# EAGLE design ArduinoBoardMK1 (EAGLE 9.2.0)
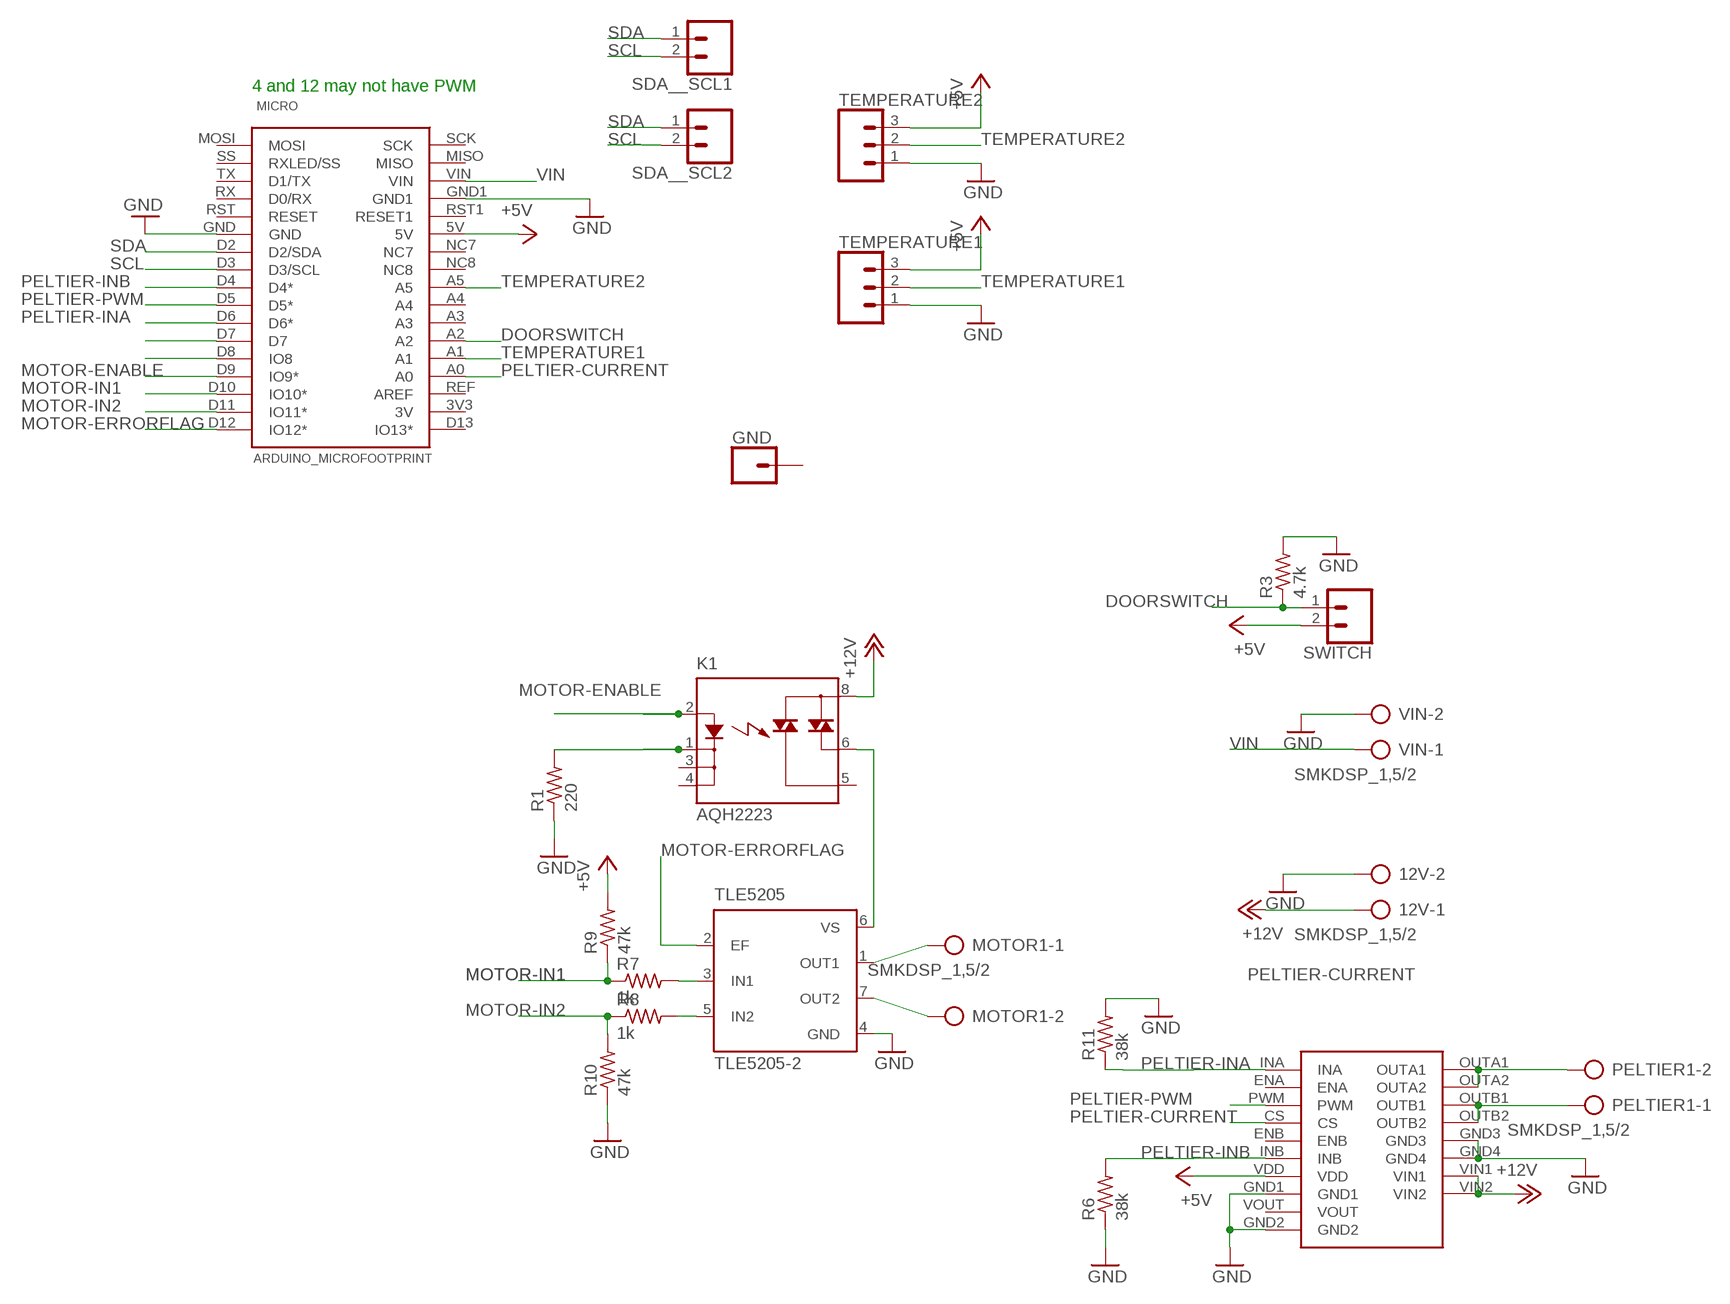
[diagram p0: schematic, sheet 1]

## Parts
12V  SMKDSP_1,5/2  [SMKDSP_1,5/2]
GND  CONN_01  [1X01]
K1  AQH2223  [DIL07]
MICRO  ARDUINO_MICROFOOTPRINT  [ARDUINO-MICRO]
MOTOR1  SMKDSP_1,5/2  [SMKDSP_1,5/2]
PELTIER1  SMKDSP_1,5/2  [SMKDSP_1,5/2]
R1  220  R-US_0207/12  [0207/12]
R3  4.7k  R-US_0207/12  [0207/12]
R6  38k  R-US_0207/12  [0207/12]
R7  1k  R-US_0207/12  [0207/12]
R8  1k  R-US_0207/12  [0207/12]
R9  47k  R-US_0207/12  [0207/12]
R10  47k  R-US_0207/12  [0207/12]
R11  38k  R-US_0207/12  [0207/12]
SDA__SCL1  CONN_02PTH3  [1X02_LONGPADS]
SDA__SCL2  CONN_02PTH3  [1X02_LONGPADS]
SWITCH  CONN_02PTH3  [1X02_LONGPADS]
TEMPERATURE1  CONN_03LONGPADS  [1X03_LONGPADS]
TEMPERATURE2  CONN_03LONGPADS  [1X03_LONGPADS]
TLE5205  TLE5205-2  [P-TO220-7-11]
VIN  SMKDSP_1,5/2  [SMKDSP_1,5/2]
VNH5019  VNH5019VNH5019BOARD  [DIP3302W60P254L2400H500Q20B]

## Nets
+5V: MICRO.5V R9.2 SWITCH.2 TEMPERATURE1.3 TEMPERATURE2.3 VNH5019.VDD
+12V: 12V.1 K1.8(DS1) VNH5019.VIN1 VNH5019.VIN2
DOORSWITCH: MICRO.A2 R3.1 SWITCH.1
GND: 12V.2 MICRO.GND MICRO.GND1 R1.1 R3.2 R6.1 R10.1 R11.2 TEMPERATURE1.1 TEMPERATURE2.1 TLE5205.4(GND) VIN.2 VNH5019.GND1 VNH5019.GND2 VNH5019.GND3 VNH5019.GND4
IN1: R7.2 TLE5205.3(IN1)
IN2: R8.2 TLE5205.5(IN2)
MOTOR-ENABLE: K1.2(A) MICRO.D9(IO9*)
MOTOR-ERRORFLAG: MICRO.D12(IO12*) TLE5205.2(EF)
MOTOR-IN1: MICRO.D10(IO10*) R7.1 R9.1
MOTOR-IN2: MICRO.D11(IO11*) R8.1 R10.2
MOTOR-OUT1: MOTOR1.1 TLE5205.1(OUT1)
MOTOR-OUT2: MOTOR1.2 TLE5205.7(OUT2)
N$21: MICRO.D7
N$22: MICRO.D8(IO8)
PELTIER-CURRENT: MICRO.A0 VNH5019.CS
PELTIER-INA: MICRO.D6(D6*) R11.1 VNH5019.INA
PELTIER-INB: MICRO.D4(D4*) R6.2 VNH5019.INB
PELTIER-OUTA: PELTIER1.2 VNH5019.OUTA1 VNH5019.OUTA2
PELTIER-OUTB: PELTIER1.1 VNH5019.OUTB1 VNH5019.OUTB2
PELTIER-PWM: MICRO.D5(D5*) VNH5019.PWM
POST-OPTO-DIODE: K1.1(K) R1.2
RELAY-TO-MOTORCONTROLLER: K1.6(DS3) TLE5205.6(VS)
SCL: MICRO.D3(D3/SCL) SDA__SCL1.2 SDA__SCL2.2
SDA: MICRO.D2(D2/SDA) SDA__SCL1.1 SDA__SCL2.1
TEMPERATURE1: MICRO.A1 TEMPERATURE1.2
TEMPERATURE2: MICRO.A5 TEMPERATURE2.2
VIN: MICRO.VIN VIN.1
Unconnected: GND.1 K1.3(K1) K1.4(K2) K1.5(DS2) MICRO.3V3(3V) MICRO.A3 MICRO.A4 MICRO.D13(IO13*) MICRO.MISO MICRO.MOSI MICRO.NC7 MICRO.NC8 MICRO.REF(AREF) MICRO.RST1(RESET1) MICRO.RST(RESET) MICRO.RX(D0/RX) MICRO.SCK MICRO.SS(RXLED/SS) MICRO.TX(D1/TX) VNH5019.ENA VNH5019.ENB VNH5019.VOUT

## Notes on the sheet
- 4 and 12 may not have PWM

## Library data of the parts
12V MOTOR1 PELTIER1 VIN = con-phoenix-smkdsp:SMKDSP_1,5/2: Printklemme, Nennstrom: 17,5 A, Bemessungsspannung: 250 V, Raster: 5,0 mm Source: http://eshop.phoenixcontact.de .. 1733415.pdf; MF: FARNELL; MPN: 1733570; OC_FARNELL: 3041244; OC_NEWARK: 69C8588
GND = SparkFun-Connectors:CONN_01: Single connection point. Often used as Generic Header-pin footprint for 0.1 inch spaced/style header connections On any of the 0.1 inch spaced packages, you can populate with these: Break Away Headers - Straight <https://www.sparkfun.com/products/116> (PRT-00116) Break Away Male Headers - Right Angle <https://www.sparkfun.com/products/553> (PRT-00553) Female Headers <https://www.sparkfun.com/products/115> (PRT-00115) Break Away Headers - Machine Pin <https://www.sparkfun.com/products/117> (PRT-00117) Break Away Female Headers - Swiss Machine Pin <https://www.sparkfun.com/products/743> (PRT-00743) This device is also useful as a general connection point to wire up your design to another part of your project. Our various solder wires solder well into these plated through hole pads. Hook-Up Wire - Assortment (Stranded, 22 AWG) <https://www.sparkfun.com/products/11375> (PRT-11375) Hook-Up Wire - Assortment (Solid Core, 22 AWG) <https://www.sparkfun.com/products/11367> (PRT-11367) View the entire wire category on our website here <https://www.sparkfun.com/categories/141> Special notes: SMTSO-256-ET is a "flush mount" nut for a 4-40 screw. We mostly use this on specialty testbeds; it is a nice way to connect hardware to your PCB at an adjustable hieght. Also note, the SNAP packages are for using a snappable style connector. We sell a baggie of snaps and they are also used on two LilyPad designs: Snap Assortment - 30 pack (male and female) <https://www.sparkfun.com/products/11347> (DEV-11347) LilyPad Arduino SimpleSnap <https://www.sparkfun.com/products/10941> (DEV-10941) LilyPad SimpleSnap Protoboard <https://www.sparkfun.com/products/10940> (DEV-10940)
K1 = relay:AQH*223: SOLID STATE RELAY NAiS Source: http://www.mew-europe.com/.. en_ds_61613_0000.pdf; MF: AROMAT/ MATSUSHITA; MPN: AQH2223; OC_FARNELL: unknown; OC_NEWARK: 26K3059
MICRO = arduino-micro:ARDUINO_MICRO
R1 R3 R6-R11 = resistor:R-US_: RESISTOR, American symbol
SDA__SCL1 SDA__SCL2 SWITCH = SparkFun-Connectors:CONN_02: Multi connection point. Often used as Generic Header-pin footprint for 0.1 inch spaced/style header connections On any of the 0.1 inch spaced packages, you can populate with these: Break Away Headers - Straight <https://www.sparkfun.com/products/116> (PRT-00116) Break Away Male Headers - Right Angle <https://www.sparkfun.com/products/553> (PRT-00553) Female Headers <https://www.sparkfun.com/products/115> (PRT-00115) Break Away Headers - Machine Pin <https://www.sparkfun.com/products/117> (PRT-00117) Break Away Female Headers - Swiss Machine Pin <https://www.sparkfun.com/products/743> (PRT-00743) For SCREWTERMINALS and SPRING TERMINALS visit here: Screw Terimnals on SparkFun.com <https://www.sparkfun.com/search/results?term=Screw+Terminals> (5mm/3.5mm/2.54mm spacing) This device is also useful as a general connection point to wire up your design to another part of your project. Our various solder wires solder well into these plated through hole pads. Hook-Up Wire - Assortment (Stranded, 22 AWG) <https://www.sparkfun.com/products/11375> (PRT-11375) Hook-Up Wire - Assortment (Solid Core, 22 AWG) <https://www.sparkfun.com/products/11367> (PRT-11367) View the entire wire category on our website here <https://www.sparkfun.com/categories/141> Special notes: Molex polarized connector foot print use with: PRT-08233 with associated crimp pins and housings. 2.54_SCREWTERM for use with PRT-10571. 3.5mm Screw Terminal footprints for PRT-08084 5mm Screw Terminal footprints for use with PRT-08432
TEMPERATURE1 TEMPERATURE2 = SparkFun-Connectors:CONN_03: Multi connection point. Often used as Generic Header-pin footprint for 0.1 inch spaced/style header connections On any of the 0.1 inch spaced packages, you can populate with these: Break Away Headers - Straight <https://www.sparkfun.com/products/116> (PRT-00116) Break Away Male Headers - Right Angle <https://www.sparkfun.com/products/553> (PRT-00553) Female Headers <https://www.sparkfun.com/products/115> (PRT-00115) Break Away Headers - Machine Pin <https://www.sparkfun.com/products/117> (PRT-00117) Break Away Female Headers - Swiss Machine Pin <https://www.sparkfun.com/products/743> (PRT-00743) Stackable Header - 3 Pin (Female, 0.1") <https://www.sparkfun.com/products/13875> (PRT-13875) For SCREWTERMINALS and SPRING TERMINALS visit here: Screw Terimnals on SparkFun.com <https://www.sparkfun.com/search/results?term=Screw+Terminals> (5mm/3.5mm/2.54mm spacing) This device is also useful as a general connection point to wire up your design to another part of your project. Our various solder wires solder well into these plated through hole pads. Hook-Up Wire - Assortment (Stranded, 22 AWG) <https://www.sparkfun.com/products/11375> (PRT-11375) Hook-Up Wire - Assortment (Solid Core, 22 AWG) <https://www.sparkfun.com/products/11367> (PRT-11367) View the entire wire category on our website here <https://www.sparkfun.com/categories/141> Special notes: Molex polarized connector foot print use with SKU : PRT-08232 with associated crimp pins and housings.
TLE5205 = infineon:TLE5205-2: 5-A H-Bridge for DC-Motor Applications Source: http://www.infineon.com .. tle5205-2.pdf; OC_FARNELL: unknown; OC_NEWARK: unknown
VNH5019 = GEMS:VNH5019

## Board
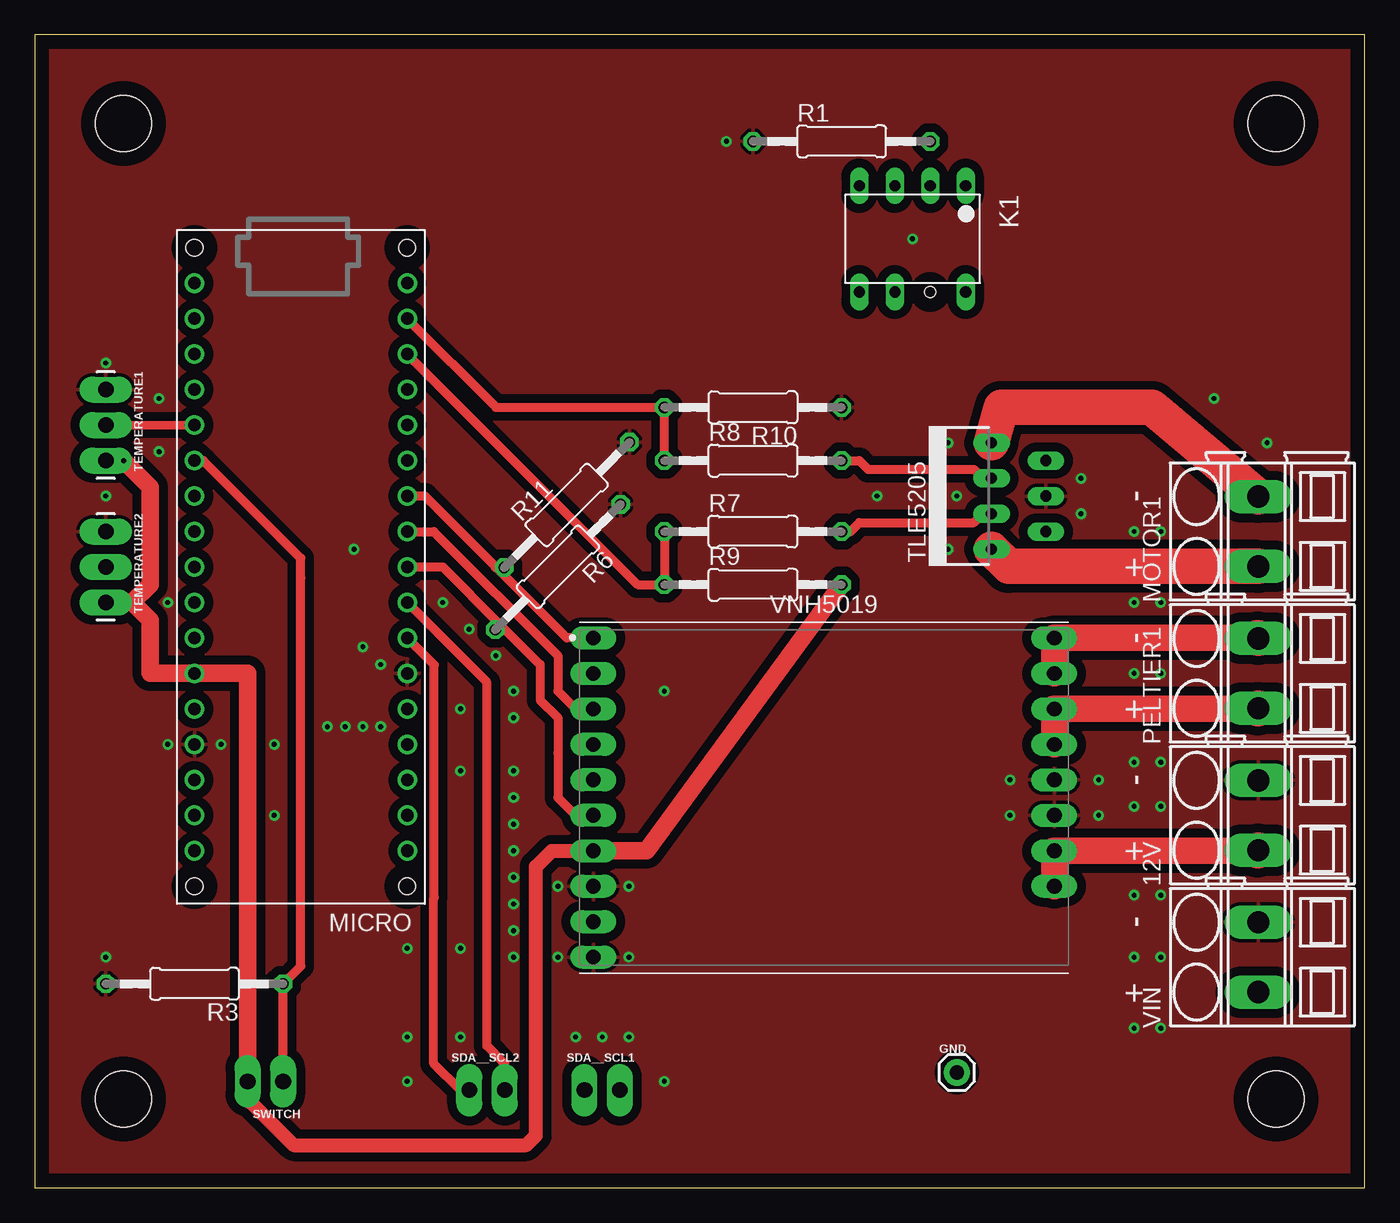
[diagram p1: board, top side]
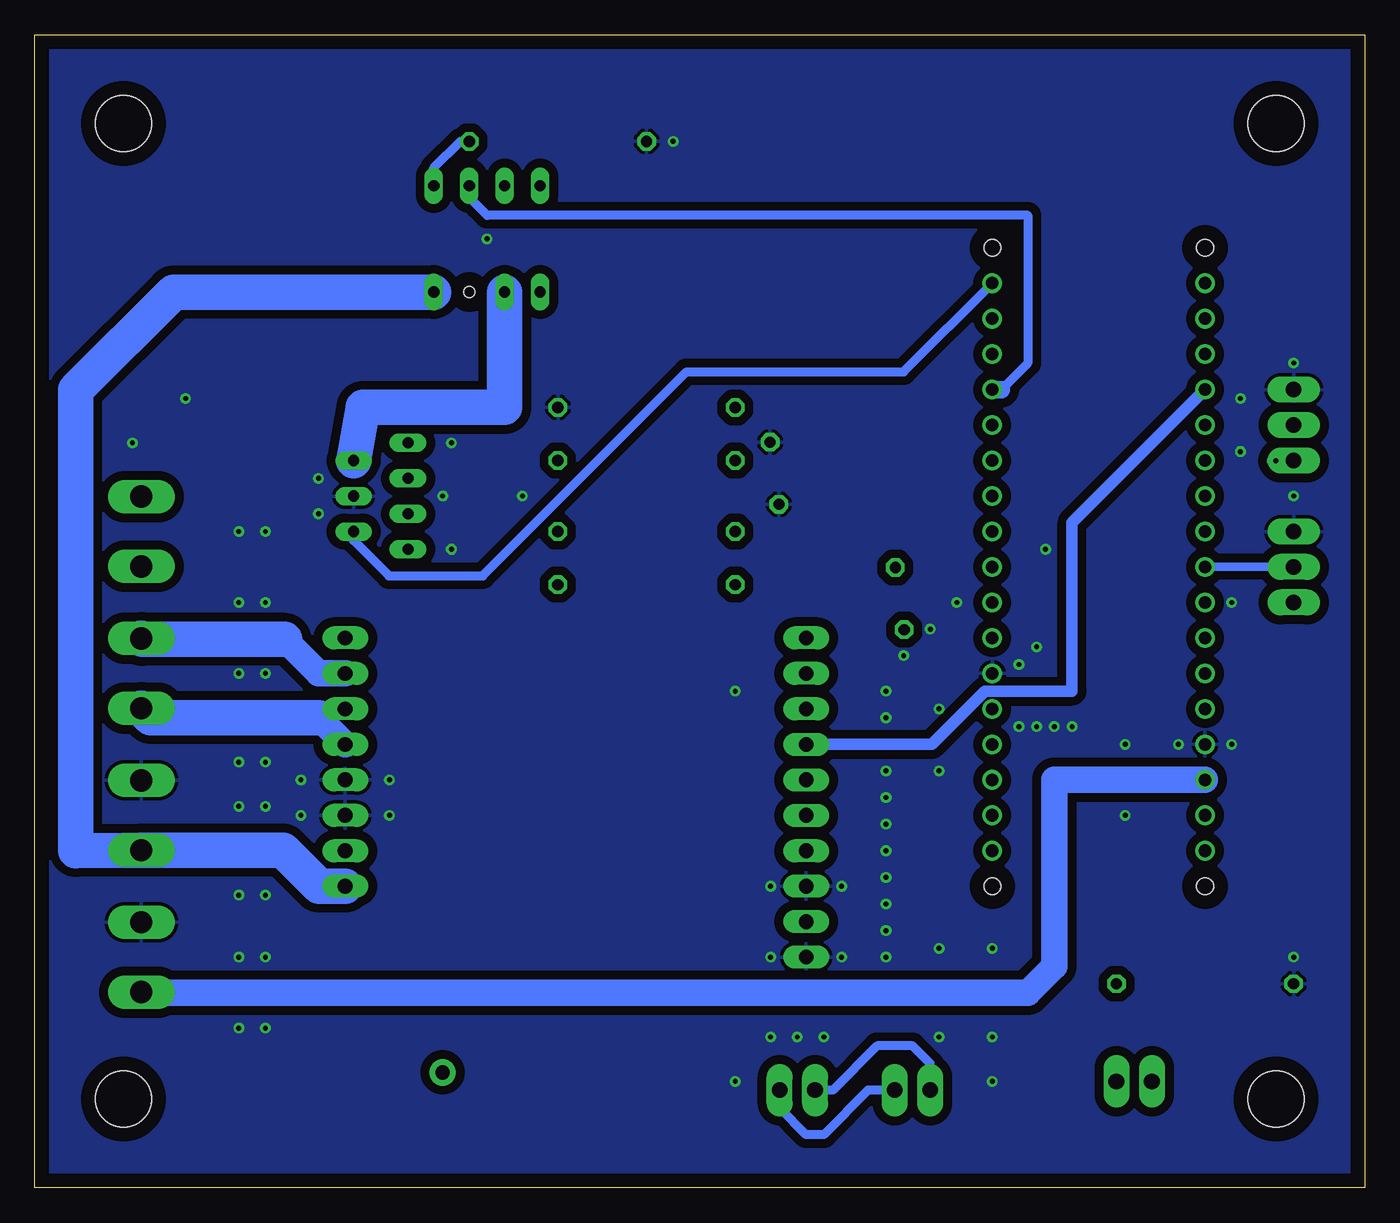
[diagram p2: board, bottom side, seen from below]

Size 95.25 x 82.55 mm. Coordinates in mm from the lower left corner, seen from the top.
Outline: 0,0 95.25,0 95.25,82.55 0,82.55 0,0
Copper layers (1*16): Top 0.035mm / dielectric 1.5mm / Bottom 0.035mm
Design rules "default *": minimum track width 6mil, minimum drill 0.35mm, track to track 25mil, track to pad 20mil, pad to pad 6mil, via to via 25mil, smd to smd 6mil, copper to edge 40mil, drill to drill 6mil, minimum pad ring 10mil, minimum via ring 8mil, stop-mask expansion 4mil, vias tented up to drill 0mil, thermal gap 10mil
Holes 4 mm at 6.35,76.2 88.9,76.2 88.9,6.35 6.35,6.35
Holes 0.8 mm at 64.14,64.14

### Footprints (pad centres in the part's own frame; a part is rotated, then mirrored left to right if it is on the bottom)
SMKDSP_1,5/2 = drill 1.6 pad 1.8 long: 1 -2.5,0; 2 2.5,0
1X01 = drill 1.016 pad 1.88: 1 0,0
DIL07 = drill 0.8 long: 1 -3.81,-3.81; 2 -1.27,-3.81; 3 1.27,-3.81; 4 3.81,-3.81; 5 3.81,3.81; 6 1.27,3.81; 8 -3.81,3.81
ARDUINO-MICRO = drill 0.9: 3V3 16.51,3.81; 5V 16.51,29.21; A0 16.51,8.89; A1 16.51,11.43; A2 16.51,13.97; A3 16.51,16.51; A4 16.51,19.05; A5 16.51,21.59; D2 1.27,26.67; D3 1.27,24.13; D4 1.27,21.59; D5 1.27,19.05; D6 1.27,16.51; D7 1.27,13.97; D8 1.27,11.43; D9 1.27,8.89; D10 1.27,6.35; D11 1.27,3.81; D12 1.27,1.27; D13 16.51,1.27; GND 1.27,29.21; GND1 16.51,34.29; MISO 16.51,39.37; MOSI 1.27,41.91; NC7 16.51,26.67; NC8 16.51,24.13; REF 16.51,6.35; RST 1.27,31.75; RST1 16.51,31.75; RX 1.27,34.29; SCK 16.51,41.91; SS 1.27,39.37; TX 1.27,36.83; VIN 16.51,36.83 | hole 1.2: 1.27,-1.27; 16.51,-1.27; 1.27,44.45; 16.51,44.45
0207/12 = drill 0.813 octagon: 1 -6.35,0; 2 6.35,0
1X02_LONGPADS = drill 1.118 pad 1.88 long: 1 0,0; 2 2.54,0
1X03_LONGPADS = drill 1.118 pad 1.88 long: 1 0,0; 2 2.54,0; 3 5.08,0
P-TO220-7-11 = drill 0.8 pad 1.2 long: 1 -3.81,-1.85; 2 -2.54,-5.75; 3 -1.27,-1.85; 4 0,-5.75; 5 1.27,-1.85; 6 2.54,-5.75; 7 3.81,-1.85
DIP3302W60P254L2400H500Q20B = drill 1.048 pad 1.649 long: CS -16.51,3.81; ENA -16.51,8.89; ENB -16.51,1.27; GND1 -16.51,-6.35; GND2 -16.51,-11.43; GND3 16.51,1.27; GND4 16.51,-1.27; INA -16.51,11.43; INB -16.51,-1.27; OUTA1 16.51,11.43; OUTA2 16.51,8.89; OUTB1 16.51,6.35; OUTB2 16.51,3.81; PWM -16.51,6.35; VDD -16.51,-3.81; VIN1 16.51,-3.81; VIN2 16.51,-6.35; VOUT -16.51,-8.89

### Placement (x,y rotation side)
12V  87.63,26.67 90 top
GND  66.04,8.26 0 top
K1  62.87,67.94 180 top
MICRO  27.94,66.04 180 top
MOTOR1  87.63,46.99 90 top
PELTIER1  87.63,36.83 90 top
R1  57.78,74.93 0 top
R3  11.43,14.61 180 top
R6  47k  [0207/12]  37.47,44.45 225 top
R7  51.44,46.99 0 top
R8  51.44,52.07 0 top
R9  51.44,43.18 0 top
R10  51.44,55.88 180 top
R11  47k  [0207/12]  38.1,48.9 45 top
SDA__SCL1  39.37,6.99 0 top
SDA__SCL2  31.11,6.99 0 top
SWITCH  17.78,7.62 180 top
TEMPERATURE1  5.08,57.15 270 top
TEMPERATURE2  5.08,46.99 270 top
TLE5205  66.67,49.53 90 top
VIN  87.63,16.51 90 top
VNH5019  56.52,27.94 0 top

### Tracks (layer width: path | path; a pad name or v marks a point on that pad's centre or on a via)
+5V  (via drill 0.35)
  Top 1.016: 15.24,6.35 18.54,3.05 35.19,3.05 35.89,3.75 35.89,22.98 37.04,24.13 VNH5019.VDD
  Top 1.27: VNH5019.VDD 43.81,24.13 R9.2 | 15.24,6.35 SWITCH.2 15.24,36.83 MICRO.5V 8.26,36.83 8.26,40.64 6.99,41.91 | v6.35,52.07 8.26,50.16 8.26,43.18 6.99,41.91 | TEMPERATURE2.3 6.99,41.91
  Bottom 1.27: TEMPERATURE1.3 v6.35,52.07
+12V
  Top 1.905: 87.59,24.13 VNH5019.VIN1 VNH5019.VIN2
  Top 2.54: 87.59,24.13 12V.1
  Bottom 2.54: K1.8 85.32,64.14 92.31,57.15 92.31,24.13 12V.1 77.47,24.17 74.89,21.59 VNH5019.VIN2
DOORSWITCH
  Top 0.635: SWITCH.1 R3.1 19.05,15.88 19.05,43.64 19.05,45.09 12.06,52.07 MICRO.A2
GND  (via drill 0.35)
  other vias: 65.41,45.72 8.89,52.7 45.09,35.56 65.41,53.34 34.29,18.41 34.29,20.32 34.29,22.23 34.29,26.04 34.29,27.94 34.29,29.84 34.29,33.66 34.29,35.56 33.02,38.1 31.11,40.01 29.21,41.91 23.5,38.73 22.86,45.72 9.53,41.91 8.89,56.52 5.08,59.05 5.08,49.53 9.53,31.75 13.34,31.75 26.67,17.14 26.67,10.79 26.67,7.62 38.73,10.79 40.64,10.79 42.55,10.79 45.09,7.62 69.85,26.67 69.85,29.21 76.2,26.67 76.2,29.21 34.29,24.13 37.47,16.51 42.55,16.51 42.55,21.59 37.47,21.59 78.74,41.91 80.64,41.91 78.74,36.83 80.64,36.83 78.74,30.48 80.64,30.48 78.74,27.3 80.64,27.3 78.74,20.95 80.64,20.95 80.64,46.99 78.74,46.99 78.74,16.51 80.64,16.51 17.14,26.67 78.74,11.43 80.64,11.43 17.14,31.75 30.48,29.84 30.48,34.29 24.77,37.47 24.77,33.02 22.23,33.02 20.95,33.02 30.48,17.14 30.48,10.79 60.33,49.53 66.04,49.53 74.93,50.8 74.93,48.26 84.45,56.52 88.27,53.34 49.53,74.93 62.87,67.94 5.08,16.51 34.29,16.51 23.5,33.02
  pour Bottom (isolate 0.381): -0.64,83.82 -0.64,-0.64 99.69,-0.64 99.69,83.82
  pour Top (isolate 0.381): -1.91,85.09 -1.91,-1.27 99.69,-1.27 99.69,85.09
IN1
  Top 0.635: R7.2 58.42,46.99 59.05,47.62 67.25,47.62 67.89,48.26 TLE5205.3
IN2
  Top 0.635: R8.2 59.05,52.07 59.69,51.44 67.25,51.44 67.89,50.8 TLE5205.5
MOTOR-ENABLE
  Bottom 0.635: 26.04,57.15 24.13,59.05 24.13,69.62 62.84,69.62 63.49,70.27 64.14,70.91 K1.2
  Bottom 1.27: 26.04,57.15 MICRO.D9
MOTOR-ERRORFLAG
  Bottom 0.635: MICRO.D12 33.02,58.42 48.57,58.42 63.17,43.81 69.89,43.81 72.42,46.35 TLE5205.2
MOTOR-IN1
  Top 0.635: R7.1 R9.1 43.18,43.18 MICRO.D10
MOTOR-IN2
  Top 0.635: R8.1 R10.2 33.02,55.88 MICRO.D11
MOTOR-OUT1
  Top 2.54: MOTOR1.1 69.75,44.49 TLE5205.1
MOTOR-OUT2
  Top 2.54: MOTOR1.2 80.01,55.88 69.22,55.88 TLE5205.7
PELTIER-CURRENT
  Bottom 0.813: VNH5019.CS 31,31.75 27.19,35.55 20.95,35.55 20.95,47.62 MICRO.A0
PELTIER-INA
  Top 0.635: MICRO.D6 27.94,49.53 33.34,44.13 | VNH5019.INA 38.1,39.37 33.34,44.13 | R11.1 32.98,44.41 | R11.1 33.34,44.13 | R11.1
PELTIER-INB
  Top 0.635: 33.34,40.32 29.21,44.45 MICRO.D4 | 33.34,40.32 36.2,37.47 36.2,34.92 37.47,33.66 37.47,31.11 37.47,27.94 38.73,26.67 39.37,26.67 VNH5019.INB | R6.2 33.34,40.32
PELTIER-OUTA
  Top 1.905: 87.59,39.37 VNH5019.OUTA1 VNH5019.OUTA2
  Top 2.54: 87.59,39.37 PELTIER1.2
  Bottom 1.905: VNH5019.OUTA2 74.92,36.83 77.36,39.27
  Bottom 2.54: PELTIER1.2 87.57,39.27 77.36,39.27
PELTIER-OUTB
  Top 1.905: 87.59,34.29 VNH5019.OUTB1 VNH5019.OUTB2
  Top 2.54: 87.59,34.29 PELTIER1.1
  Bottom 1.905: VNH5019.OUTB2 74.93,33.66
  Bottom 2.54: PELTIER1.1 86.95,33.66 74.93,33.66
PELTIER-PWM
  Top 0.635: MICRO.D5 28.57,46.99 37.47,38.1 37.47,35.56 38.73,34.29 VNH5019.PWM
POST-OPTO-DIODE
  Bottom 0.635: K1.1 66.67,73.03 64.77,74.93 R1.2
RELAY-TO-MOTORCONTROLLER
  Bottom 2.54: TLE5205.6 71.75,55.88 61.59,55.88 61.59,61.78 K1.6
SCL
  Top 0.635: MICRO.D3 32.38,36.2 32.38,10.16 33.66,8.89 SDA__SCL2.2
  Bottom 0.635: SDA__SCL1.2 41.91,5.71 40.01,3.81 38.73,3.81 35.56,6.99 SDA__SCL2.2
SDA
  Top 0.635: MICRO.D2 27.3,38.73 28.6,37.44 28.6,20.79 28.57,20.76 28.57,8.89 30.48,6.99 SDA__SCL2.1
  Bottom 0.635: SDA__SCL2.1 31.11,8.89 32.38,10.16 34.92,10.16 38.1,6.99 SDA__SCL1.1
TEMPERATURE1
  Top 0.61: MICRO.A1 TEMPERATURE1.2
TEMPERATURE2
  Bottom 0.61: TEMPERATURE2.2 MICRO.A5
VIN
  Bottom 1.905: MICRO.VIN 22.23,29.21 22.23,15.88 24.13,13.97 87.59,13.97 VIN.1

### Text on the board
tNames: - | + | - | + | - | + | - | +